# Altium schematic sheet Control.SchDoc
size A1; PageSetup: Record=PageOptions|CenterHorizontal=True|CenterVertical=True|PrintScale=0.50|XCorrection=1.00|YCorrection=1.00|PrintKind=1|BorderSize=5000000|LeftOffset=0|BottomOffset=0|Orientation=2|PaperLength=1000|PaperWidth=1000|Scale=100|PaperSource=7|PrintQuality=-4|MediaType=1|DitherType=10|PrintScaleMode=1|PaperKind=A3
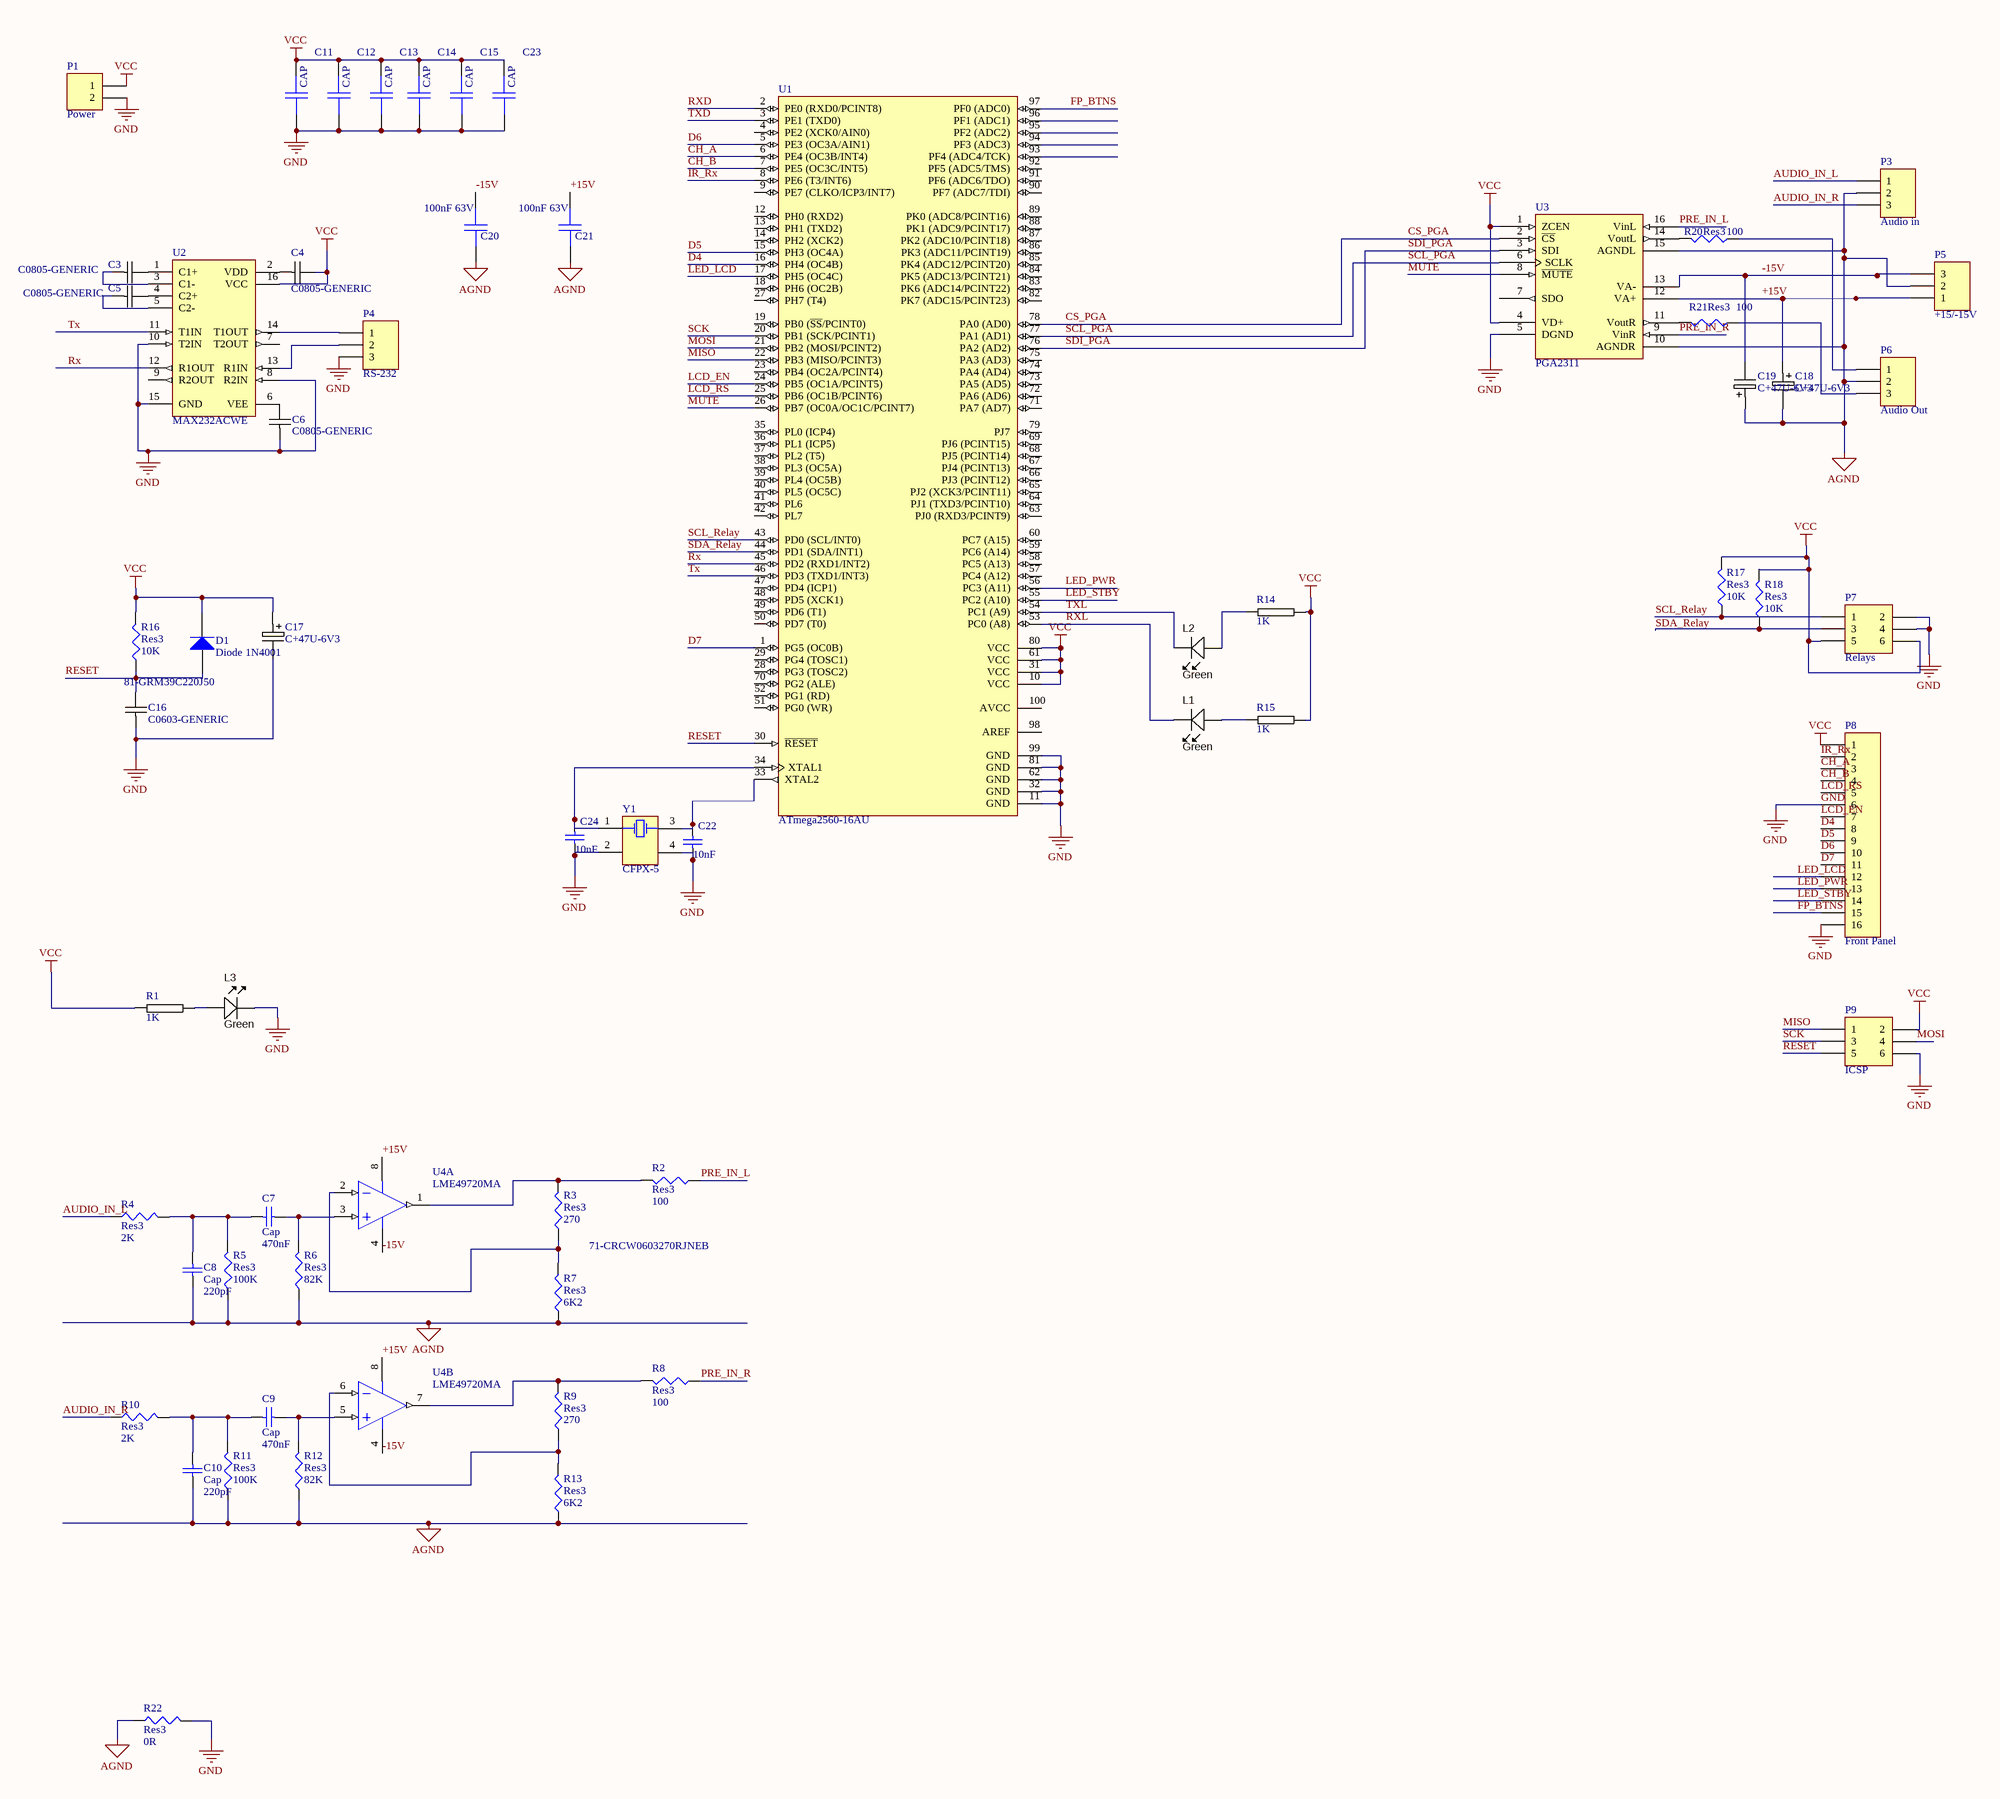
[diagram p0: Control.SchDoc]

## Parts
C3  C0805-GENERIC  [0805C-GENERIC]
C4  C0805-GENERIC  [0805C-GENERIC]
C5  C0805-GENERIC  [0805C-GENERIC]
C6  C0805-GENERIC  [0805C-GENERIC]
C7  Cap  value 470nF  [CAPC3225X220N]
C8  Cap  value 220pF  [CAPC2012X135N]
C9  Cap  value 470nF  [CAPC3225X220N]
C10  Cap  value 220pF  [CAPC2012X135N]
C11  CAP  [CAPC2012]
C12  CAP  [CAPC2012]
C13  CAP  [CAPC2012]
C14  CAP  [CAPC2012]
C15  CAP  [CAPC2012]
C16  C0603-GENERIC  Supplier Part Number 1: 81-GRM39C220J50  [CAPC1608]
C17  C+47U-6V3  [PANACAP-C]
C18  C+47U-6V3  [PANACAP-C]
C19  C+47U-6V3  [PANACAP-C]
C20  100nF 63V  [CAPC3216B]
C21  100nF 63V  [CAPC3216B]
C22  10nF  [CAPC1005L]
C23  CAP  [CAPC2012]
C24  10nF  [CAPC1005L]
D1  Diode 1N4001  [1206 Diode]
L1  Color: Green  [LED-0805-K]
L2  Color: Green  [LED-0805-K]
L3  Color: Green  [LED-0805-K]
P1  Power  [PH_TERM_2]
P3  Audio in  [PH_TERM_3]
P4  RS-232  [HDR1X3H]
P5  +15/-15V  [PH_TERM_3]
P6  Audio Out  [PH_TERM_3]
P7  Relays  [HDR2X3H]
P8  Front Panel  [IDC2.54-H16C]
P9  ICSP  [HDR2X3]
R1  1K  [0805R-1K]
R2  Res3  value 100  [J1-0603]
R3  Res3  value 270  Supplier Part Number 1: 71-CRCW0603270RJNEB  [J1-0603]
R4  Res3  value 2K  [J1-0603]
R5  Res3  value 100K  [J1-0603]
R6  Res3  value 82K  [J1-0603]
R7  Res3  value 6K2  [J1-0603]
R8  Res3  value 100  [J1-0603]
R9  Res3  value 270  [J1-0603]
R10  Res3  value 2K  [J1-0603]
R11  Res3  value 100K  [J1-0603]
R12  Res3  value 82K  [J1-0603]
R13  Res3  value 6K2  [J1-0603]
R14  1K  [0805R-1K]
R15  1K  [0805R-1K]
R16  Res3  value 10K  [J1-0603]
R17  Res3  value 10K  [J1-0603]
R18  Res3  value 10K  [J1-0603]
R20  Res3  value 100  [J1-0603]
R21  Res3  value 100  [J1-0603]
R22  Res3  value 0R  [J1-0603]
U1  ATmega2560-16AU  [100A_N]
U2  MAX232ACWE  [WSO16_N]
U3  PGA2311  [TI-DW16_L]
U4  LME49720MA  [M08A_N]  (parts A,B of 2)
Y1  CFPX-5  [CFPX-5]

## Nets
AGND: C8.1 C10.2 C18.- C19.+ C20.2 C21.2 P3.2 P5.2 P6.2 R5.1 R6.1 R7.1 R11.1 R12.1 R13.1 R22.1 U3.10(AGNDR) U3.15(AGNDL)
GND: C6.1 C11.2 C12.2 C13.2 C14.2 C15.2 C16.1 C17.- C22.1 C23.2 C24.1 L3.K P1.2 P4.3 P7.2 P7.4 P8.6 P8.16 P9.6 R22.2 U1.11(GND) U1.32(GND) U1.62(GND) U1.81(GND) U1.99(GND) U2.8(R2IN) U2.10(T2IN) U2.15(GND) U3.5(DGND) Y1.2(NC) Y1.4(NC)
VCC: C4.2 C11.1 C12.1 C13.1 C14.1 C15.1 C17.+ C23.1 D1.2(K) P1.1 P7.5 P7.6 P8.1 P9.2 R1.1 R14.2 R15.2 R16.2 R17.2 R18.2 U1.10(VCC) U1.31(VCC) U1.61(VCC) U1.80(VCC) U2.16(VCC) U3.1(ZCEN) U3.4(VD+)
+15V: C18.+ C21.1 P5.1 U3.12(VA+) U4.8(V+)
-15V: C19.- C20.1 P5.3 U3.13(VA-) U4.4(V-)
AUDIO_IN_L: P3.1 R4.1
AUDIO_IN_R: P3.3 R10.1
CH_A: P8.3 U1.6(PE4_(OC3B/INT4))
CH_B: P8.4 U1.7(PE5_(OC3C/INT5))
CS_PGA: U1.78(PA0_(AD0)) U3.2(~{CS})
D4: P8.8 U1.16(PH4_(OC4B))
D5: P8.9 U1.15(PH3_(OC4A))
D6: P8.10 U1.5(PE3_(OC3A/AIN1))
D7: P8.11 U1.1(PG5_(OC0B))
FP_BTNS: P8.15 U1.97(PF0_(ADC0))
IR_Rx: P8.2 U1.8(PE6_(T3/INT6))
LCD_EN: P8.7 U1.24(PB5_(OC1A/PCINT5))
LCD_RS: P8.5 U1.25(PB6_(OC1B/PCINT6))
LED_LCD: P8.12 U1.17(PH5_(OC4C))
LED_PWR: P8.13 U1.56(PC3_(A11))
LED_STBY: P8.14 U1.55(PC2_(A10))
MISO: P9.1 U1.22(PB3_(MISO/PCINT3))
MOSI: P9.4 U1.21(PB2_(MOSI/PCINT2))
MUTE: U1.26(PB7_(OC0A/OC1C/PCINT7)) U3.8(~{MUTE})
PRE_IN_L: R2.1 U3.16(VinL)
PRE_IN_R: R8.1 U3.9(VinR)
RESET: C16.2 D1.1(A) P9.5 R16.1 U1.30(~{RESET})
Rx: U1.45(PD2_(RXD1/INT2)) U2.12(R1OUT)
RXD: U1.2(PE0_(RXD0/PCINT8))
RXL: L1.K U1.53(PC0_(A8))
SCK: P9.3 U1.20(PB1_(SCK/PCINT1))
SCL_PGA: U1.77(PA1_(AD1)) U3.6(SCLK)
SCL_Relay: P7.1 R17.1 U1.43(PD0_(SCL/INT0))
SDA_Relay: P7.3 R18.1 U1.44(PD1_(SDA/INT1))
SDI_PGA: U1.76(PA2_(AD2)) U3.3(SDI)
Tx: U1.46(PD3_(TXD1/INT3)) U2.11(T1IN)
TXD: U1.3(PE1_(TXD0))
TXL: L2.K U1.54(PC1_(A9))
NetC3_1: C3.1 U2.3(C1-)
NetC3_2: C3.2 U2.1(C1+)
NetC4_1: C4.1 U2.2(VDD)
NetC5_1: C5.1 U2.5(C2-)
NetC5_2: C5.2 U2.4(C2+)
NetC6_2: C6.2 U2.6(VEE)
NetC7_1: C7.1 R6.2 U4.3(IN_A)
NetC7_2: C7.2 C8.2 R4.2 R5.2
NetC9_1: C9.1 C10.1 R10.2 R11.2
NetC9_2: C9.2 R12.2 U4.5(IN_B)
NetC22_2: C22.2 U1.33(XTAL2) Y1.3(OSC2)
NetC24_2: C24.2 U1.34(XTAL1) Y1.1(OSC1)
NetL1_A: L1.A R15.1
NetL2_A: L2.A R14.1
NetL3_A: L3.A R1.2
NetP4_1: P4.1 U2.14(T1OUT)
NetP4_2: P4.2 U2.13(R1IN)
NetP6_1: P6.1 R20.1
NetP6_3: P6.3 R21.1
NetR2_2: R2.2 R3.2 U4.1(OUT_A)
NetR3_1: R3.1 R7.2 U4.2(IN_A)
NetR8_2: R8.2 R9.2 U4.7(OUT_B)
NetR9_1: R9.1 R13.2 U4.6(IN_B)
NetR20_2: R20.2 U3.14(VoutL)
NetR21_2: R21.2 U3.11(VoutR)

Not connected (* = marked no-connect by the designer): U1 4(PE2_(XCK0/AIN0)) 9(PE7_(CLKO/ICP3/INT7)) 12(PH0_(RXD2)) 13(PH1_(TXD2)) 14(PH2_(XCK2)) 18(PH6_(OC2B)) 19(PB0_(~{SS}/PCINT0)) 23(PB4_(OC2A/PCINT4)) 27(PH7_(T4)) 28(PG3_(TOSC2)) 29(PG4_(TOSC1)) 35(PL0_(ICP4)) 36(PL1_(ICP5)) 37(PL2_(T5)) 38(PL3_(OC5A)) 39(PL4_(OC5B)) 40(PL5_(OC5C)) 41(PL6) 42(PL7) 47(PD4_(ICP1)) 48(PD5_(XCK1)) 49(PD6_(T1)) 50(PD7_(T0)) 51(PG0_(WR)) 52(PG1_(RD)) 57(PC4_(A12)) 58(PC5_(A13)) 59(PC6_(A14)) 60(PC7_(A15)) 63(PJ0_(RXD3/PCINT9)) 64(PJ1_(TXD3/PCINT10)) 65(PJ2_(XCK3/PCINT11)) 66(PJ3_(PCINT12)) 67(PJ4_(PCINT13)) 68(PJ5_(PCINT14)) 69(PJ6_(PCINT15)) 70(PG2_(ALE)) 71(PA7_(AD7)) 72(PA6_(AD6)) 73(PA5_(AD5)) 74(PA4_(AD4)) 75(PA3_(AD3)) 79(PJ7) 82(PK7_(ADC15/PCINT23)) 83(PK6_(ADC14/PCINT22)) 84(PK5_(ADC13/PCINT21)) 85(PK4_(ADC12/PCINT20)) 86(PK3_(ADC11/PCINT19)) 87(PK2_(ADC10/PCINT18)) 88(PK1_(ADC9/PCINT17)) 89(PK0_(ADC8/PCINT16)) 90(PF7_(ADC7/TDI)) 91(PF6_(ADC6/TDO)) 92(PF5_(ADC5/TMS)) 93(PF4_(ADC4/TCK)) 94(PF3_(ADC3)) 95(PF2_(ADC2)) 96(PF1_(ADC1)) 98(AREF) 100(AVCC); U2 7(T2OUT) 9(R2OUT); U3 7(SDO)

## Library data of the parts
C3 C5 C6 = C0805-GENERIC: GENERIC CAPACITOR NON POLARISED0603
C4 = C0805-GENERIC: GENERIC CAPACITOR NON POLARISED0805
C7-C10 C22 C24 = Cap: Capacitor; Published: 8-Jun-2000; LatestRevisionDate: 17-Jul-2002; LatestRevisionNote: Re-released for DXP Platform.; PackageReference: RAD-0.3; Publisher: Altium Limited; PackageDescription: Radial Cap, Thru-Hole; 2 Leads; 0.3 in Pin Spacing
C11-C15 C23 = CAP: Capacitor; Part No.: Not Part; 1 Unit Cost AU$: 0.00; 1 Unit Cost US$: 0.00; 2 Unit Cost AU$: 0.00; 2 Unit Cost US$: 0.00
C16 = C0805-GENERIC: GENERIC CAPACITOR NON POLARISED 22pf; Manufacturer: Murata Electronics; Manufacturer Part Number: GRM1885C1H220JA01D; Tolerance: 5 %; Type: General Purpose MLCC; Voltage Rating DC: 50 V; Case Height: 0.8 mm; Case Length: 1.6 mm; Dielectric: C0G (NP0); Temperature Coefficient / Code: +/- 30 PPM / C; Supplier 1: Mouser; RoHS: RoHS Compliant; Category: Multilayer Ceramic Capacitors MLCC - SMD/SMT; Stock 1: 280864; Pricing 1: 1=0.386, 10=0.049, 100=0.030, 1000=0.022, 4000=0.019, 8000=0.016, 24000=0.015, 48000=0.013, 100000=0.010 (AUD); Capacitance: 22 pF; Operating Temperature Range: - 55 C to + 125 C; Package / Case: 0603 (1608 metric); Packaging: Reel; Product: General Type MLCCs; Series: GRM; Termination Style: SMD/SMT; Brand: Murata Electronics; Case Code - in: 0603; Case Code - mm: 1608; Case Width: 0.8 mm; Maximum Operating Temperature: + 125 C; Minimum Operating Temperature: - 55 C; Product Category: Low & Medium Capacitance SMD Ceramic Chip Capacitors; Standard Pack Qty: 4000; RoHS - Mouser: Y; Minimum Order Quantity: 1; Reeling: True; ComponentLink1URL: http://www.murata.com/products/catalog/pdf/c02e.pdf; ComponentLink1Description: http://www.murata.com/products/catalog/pdf/c02e.pdf
C17-C19 = C+47U-6V3: GENERIC CAPACITOR POLARISED; Supplier 1: Digi-Key; Supplier Part Number 1: PCE4375TR-ND
C20 C21 = CAP: Part No.: Not Part; 1 Unit Cost AU$: 0.00; 1 Unit Cost US$: 0.00; 2 Unit Cost AU$: 0.00; 2 Unit Cost US$: 0.00
D1 = Diode 1N4001: 1 Amp General Purpose Rectifier; Published: 8-Jun-2000; LatestRevisionDate: 17-Jul-2002; LatestRevisionNote: Re-released for DXP Platform.; DatasheetVersion: 1998; PackageVersion: Aug-1999; PackageReference: DO-41; Publisher: Altium Limited; PackageDescription: Diode, Axial; Body 5.2 x 2.7 mm (LxDia. max), Lead Dia. 0.86 mm (max); Code_JEDEC: DO-204-AL; ComponentLink1Description: Manufacturer Link; ComponentLink1URL: http://www.fairchildsemi.com/; ComponentLink2Description: Datasheet; ComponentLink2URL: http://www.fairchildsemi.com/ds/1N%2F1N4001.pdf
L1-L3 = LED_SMD_Green_0805_6mcd: LED, 0805 SMD, Green; Manufacturer 1: LITE-ON; Manufacturer Part Number 1: LTST-C171GKT; Material: GaP; Ratings: 6 mcd; 569 nm; SCDType: source; Package / Case: 0805; Supplier 1: Digi-Key; Supplier Part Number 1: 160-1423-1-ND; Value: Green
P1 = Header 2: Header, 2-Pin; LatestRevisionDate: 17-Jul-2002; LatestRevisionNote: Re-released for DXP Platform.; Publisher: Altium Limited
P3 P5 P6 = Header 3: Header, 3-Pin; LatestRevisionDate: 17-Jul-2002; LatestRevisionNote: Re-released for DXP Platform.; Publisher: Altium Limited
P4 = Header 3H: Header, 3-Pin, Right Angle; LatestRevisionDate: 17-Jul-2002; LatestRevisionNote: Re-released for DXP Platform.; Publisher: Altium Limited
P7 = Header 3X2H: Header, 3-Pin, Dual row, Right Angle; LatestRevisionDate: 17-Jul-2002; LatestRevisionNote: Re-released for DXP Platform.; Publisher: Altium Limited
P8 = Header 16: Header, 16-Pin; LatestRevisionDate: 17-Jul-2002; LatestRevisionNote: Re-released for DXP Platform.; Publisher: Altium Limited
P9 = Header 3X2: Header, 3-Pin, Dual row; LatestRevisionDate: 17-Jul-2002; LatestRevisionNote: Re-released for DXP Platform.; Publisher: Altium Limited
R1 R14 R15 = 0805R-1K: RESISTOR 0805 1/4 WATT THIN FILM; Reel: *
R2-R13 R16-R18 R20-R22 = Res3: Resistor; Published: 8-Jun-2000; LatestRevisionDate: 29-May-2009; LatestRevisionNote: IPC-7351 Footprint Added.; PackageReference: J1-0603; Publisher: Altium Limited; PackageDescription: Chip Resistor
  R3: Supplier 1: Mouser
U1 = ATmega2560-16AU: 8-bit AVR Microcontroller, 4.5-5.5V, 256KB Flash, 4KB EEPROM, 8KB SRAM, 86 GPIO pins, 100-pin TQFP, Industrial Grade (-40°C to 85°C), Pb-Free; Published: 1-Apr-2010; DatasheetVersion: revL, Aug-2007; PackageVersion: revC, Oct-2001; PackageReference: 100A; Publisher: Altium Limited; PackageDescription: 100-Pin Thin Profile Plastic Quad Flat Pack (TQFP), 14 x 14 x 1.0 mm Body, 0.5 mm Pitch; Supplier 1: Digi-Key; Supplier Part Number 1: ATMEGA2560-16AU-ND; Supplier 2: Farnell; Supplier Part Number 2: 1288330; Supplier 3: Farnell; Supplier Part Number 3: 1661740; Supplier 4: Mouser; Supplier Part Number 4: 556-ATMEGA2560-16AU; Code_JEDEC: MS-026-AED; ComponentLink1Description: Manufacturer Link; ComponentLink1URL: http://www.atmel.com/products/avr/default.asp?; ComponentLink2Description: ATmega640/1280/1281/2560/2561 Datasheet; ComponentLink2URL: http://www.atmel.com/dyn/resources/prod_documents/doc2549.pdf; ComponentLink3Description: ATmega640/1280/1281/2560/2561 Summary; ComponentLink3URL: http://www.atmel.com/dyn/resources/prod_documents/2549S.pdf; ComponentLink4Description: Atmel.com Home; ComponentLink4URL: http://www.atmel.com
U2 = MAX232ACWE: +5V Powered, Multi-Channel RS-232 Driver/Receiver; Published: 16-Jan-2001; LatestRevisionDate: 13-Apr-2006; LatestRevisionNote: IPC-7351 Footprint Added.; PackageReference: WSO16; Publisher: Altium Limited; PackageDescription: 16-Pin Small Outline Integrated Circuit 1.27 mm Pitch; Code_JEDEC: MS-013-AA; Code_IPC: SOIC127P1030-16; ComponentLink1Description: Manufacturer Link; ComponentLink1URL: http://www.maxim-ic.com/; ComponentLink2Description: Datasheet; ComponentLink2URL: http://pdfserv.maxim-ic.com/en/ds/MAX220-MAX249.pdf
U4 = LME49720MA: Dual High Performance, High Fidelity Audio Operational Amplifier, 8-pin Narrow SOIC; Manufacturer: National Semiconductor; PackageTopMarking: NSZXTT*L49720*MA; PowerWise: Y; CompType: Audio IC; Published: 4-Dec-2008; LatestRevisionDate: 01-Mar-2010; LatestRevisionNote: Sch layout changed.; DatasheetVersion: Oct-2007; PackageReference: M08A; Publisher: Altium Limited; PackageDescription: SOIC Narrow, 4.9 x 3.9 x 1.45mm, 8 Lead, 1.27mm Pitch; Code_JEDEC: MS-012-AA; Code_IPC: SOIC127P600-8; ComponentLink1Description: LME49720 Datasheet; ComponentLink1URL: http://www.national.com/ds/LM/LME49720.pdf; ComponentLink2Description: LME49720 Web Page; ComponentLink2URL: http://www.national.com/pf/LM/LME49720.html; PackageVersion: revM, May-2009; Supplier 1: Farnell; Supplier Part Number 1: 1433166; PartNumber: LME49720MA; RoHS: Y; PinCount: 8; ComponentLink3Description: M08A Package Page; ComponentLink3URL: http://www.national.com/packaging/folders/m08a.html
Y1 = CFPX-5: Surface Mount Quartz Crystal; Note: PCB layout complies with manufacturer's recommendation.; Published: 17-Jul-2002; DatasheetDocument: 9-Sep-1999; PackageDocument: 9-Sep-1999; PackageReference: CFPX-5; Publisher: Altium Limited; ComponentLink1Description: Manufacturer Link; ComponentLink1URL: http://www.cmac.com/mt/